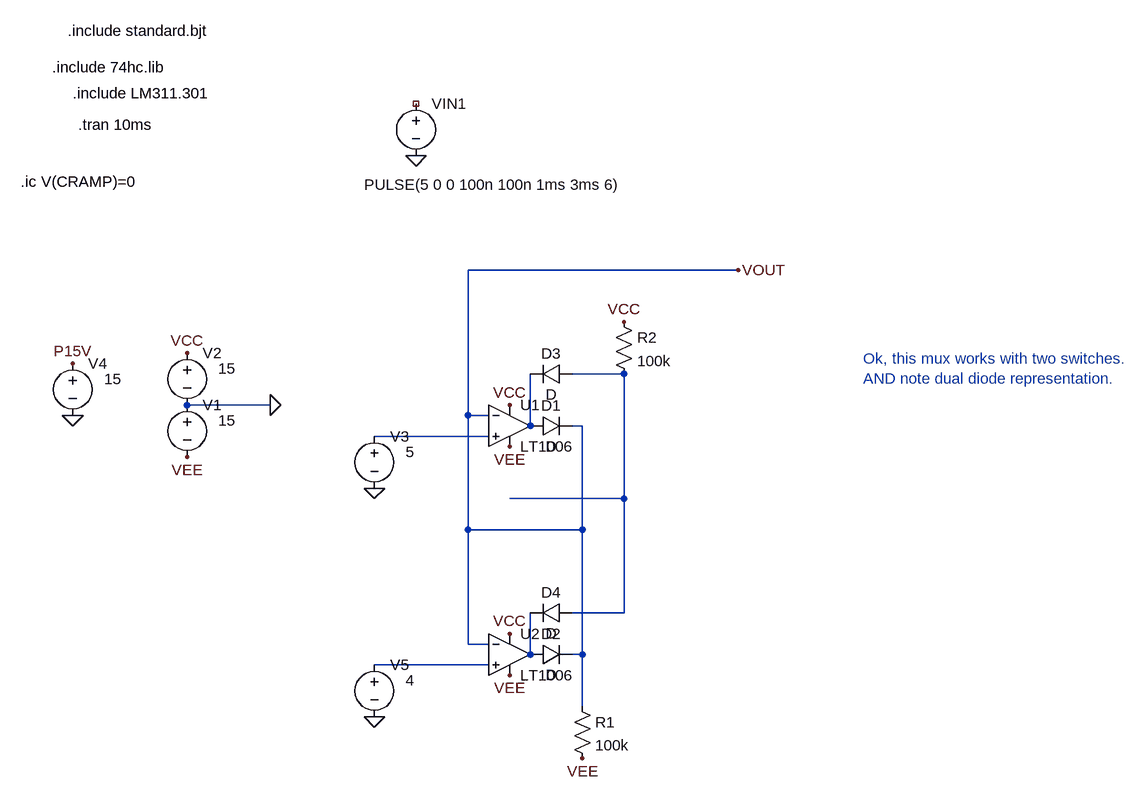
[diagram p0: schematic Draft97.asc]
Draft97.asc, the LTspice schematic file:
Version 4
SHEET 1 5720 1884
WIRE 848 0 432 0
WIRE 672 160 592 160
WIRE 128 208 0 208
WIRE 432 224 432 0
WIRE 464 224 432 224
WIRE 528 240 528 160
WIRE 608 240 592 240
WIRE 464 256 288 256
WIRE 672 352 672 160
WIRE 672 352 496 352
WIRE 432 400 432 224
WIRE 608 400 608 240
WIRE 608 400 432 400
WIRE 672 528 672 352
WIRE 672 528 592 528
WIRE 432 576 432 400
WIRE 464 576 432 576
WIRE 528 592 528 528
WIRE 608 592 608 400
WIRE 608 592 592 592
WIRE 464 608 288 608
WIRE 608 672 608 592
FLAG 0 128 VCC
FLAG -176 224 0
FLAG -176 144 P15V
FLAG 352 -176 0
FLAG 0 288 VEE
FLAG 128 208 0
FLAG 496 208 VCC
FLAG 496 272 VEE
FLAG 496 560 VCC
FLAG 496 624 VEE
FLAG 608 752 VEE
FLAG 288 336 0
FLAG 288 688 0
FLAG 848 0 VOUT
FLAG 672 80 VCC
SYMBOL voltage 0 112 R0
WINDOW 123 0 0 Left 0
WINDOW 39 0 0 Left 0
WINDOW 3 48 40 Left 2
SYMATTR Value 15
SYMATTR InstName V2
SYMBOL voltage -176 128 R0
WINDOW 123 0 0 Left 0
WINDOW 39 0 0 Left 0
WINDOW 3 48 40 Left 2
SYMATTR Value 15
SYMATTR InstName V4
SYMBOL voltage 352 -272 R0
WINDOW 123 0 0 Left 0
WINDOW 39 0 0 Left 0
WINDOW 3 -80 141 Left 2
SYMATTR Value PULSE(5 0 0 100n 100n 1ms 3ms 6)
SYMATTR InstName VIN1
SYMBOL OpAmps\\LT1006 496 176 R0
SYMATTR InstName U1
SYMBOL voltage 0 192 R0
WINDOW 123 0 0 Left 0
WINDOW 39 0 0 Left 0
WINDOW 3 48 40 Left 2
SYMATTR Value 15
SYMATTR InstName V1
SYMBOL diode 528 256 R270
WINDOW 0 32 32 VTop 2
WINDOW 3 0 32 VBottom 2
SYMATTR InstName D1
SYMBOL diode 528 608 R270
WINDOW 0 32 32 VTop 2
WINDOW 3 0 32 VBottom 2
SYMATTR InstName D2
SYMBOL OpAmps\\LT1006 496 528 R0
SYMATTR InstName U2
SYMBOL res 592 656 R0
SYMATTR InstName R1
SYMATTR Value 100k
SYMBOL voltage 288 240 R0
WINDOW 123 0 0 Left 0
WINDOW 39 0 0 Left 0
WINDOW 3 48 40 Left 2
SYMATTR Value 5
SYMATTR InstName V3
SYMBOL voltage 288 592 R0
WINDOW 123 0 0 Left 0
WINDOW 39 0 0 Left 0
WINDOW 3 48 40 Left 2
SYMATTR Value 4
SYMATTR InstName V5
SYMBOL diode 592 144 R90
WINDOW 0 0 32 VBottom 2
WINDOW 3 32 32 VTop 2
SYMATTR InstName D3
SYMBOL diode 592 512 R90
WINDOW 0 0 32 VBottom 2
WINDOW 3 32 32 VTop 2
SYMATTR InstName D4
SYMBOL res 656 64 R0
SYMATTR InstName R2
SYMATTR Value 100k
TEXT -168 -224 Left 2 !.tran 10ms
TEXT -208 -312 Left 2 !.include 74hc.lib
TEXT -184 -368 Left 2 !.include standard.bjt
TEXT -176 -272 Left 2 !.include LM311.301
TEXT -256 -136 Left 2 !.ic V(CRAMP)=0
TEXT 1040 136 Left 2 ;Ok, this mux works with two switches.\nAND note dual diode representation.

The netlist it stands for:
* Draft97.asc
V2 VCC 0 15
V4 P15V 0 15
VIN1 NC_01 0 PULSE(5 0 0 100n 100n 1ms 3ms 6)
XU1 N003 VOUT VCC VEE N002 LT1006  ; pins In+ In- V+ V- OUT
V1 0 VEE 15
D1 N002 VOUT D
D2 N004 VOUT D
XU2 N005 VOUT VCC VEE N004 LT1006  ; pins In+ In- V+ V- OUT
R1 VOUT VEE 100k
V3 N003 0 5
V5 N005 0 4
D3 N001 N002 D
D4 N001 N004 D
R2 VCC N001 100k
.model D D
.lib standard.dio
.tran 10ms
.include 74hc.lib
.include standard.bjt
.include LM311.301
.ic V(CRAMP)=0
* Ok, this mux works with two switches.
* AND note dual diode representation.
.lib LTC.lib
.backanno
.end